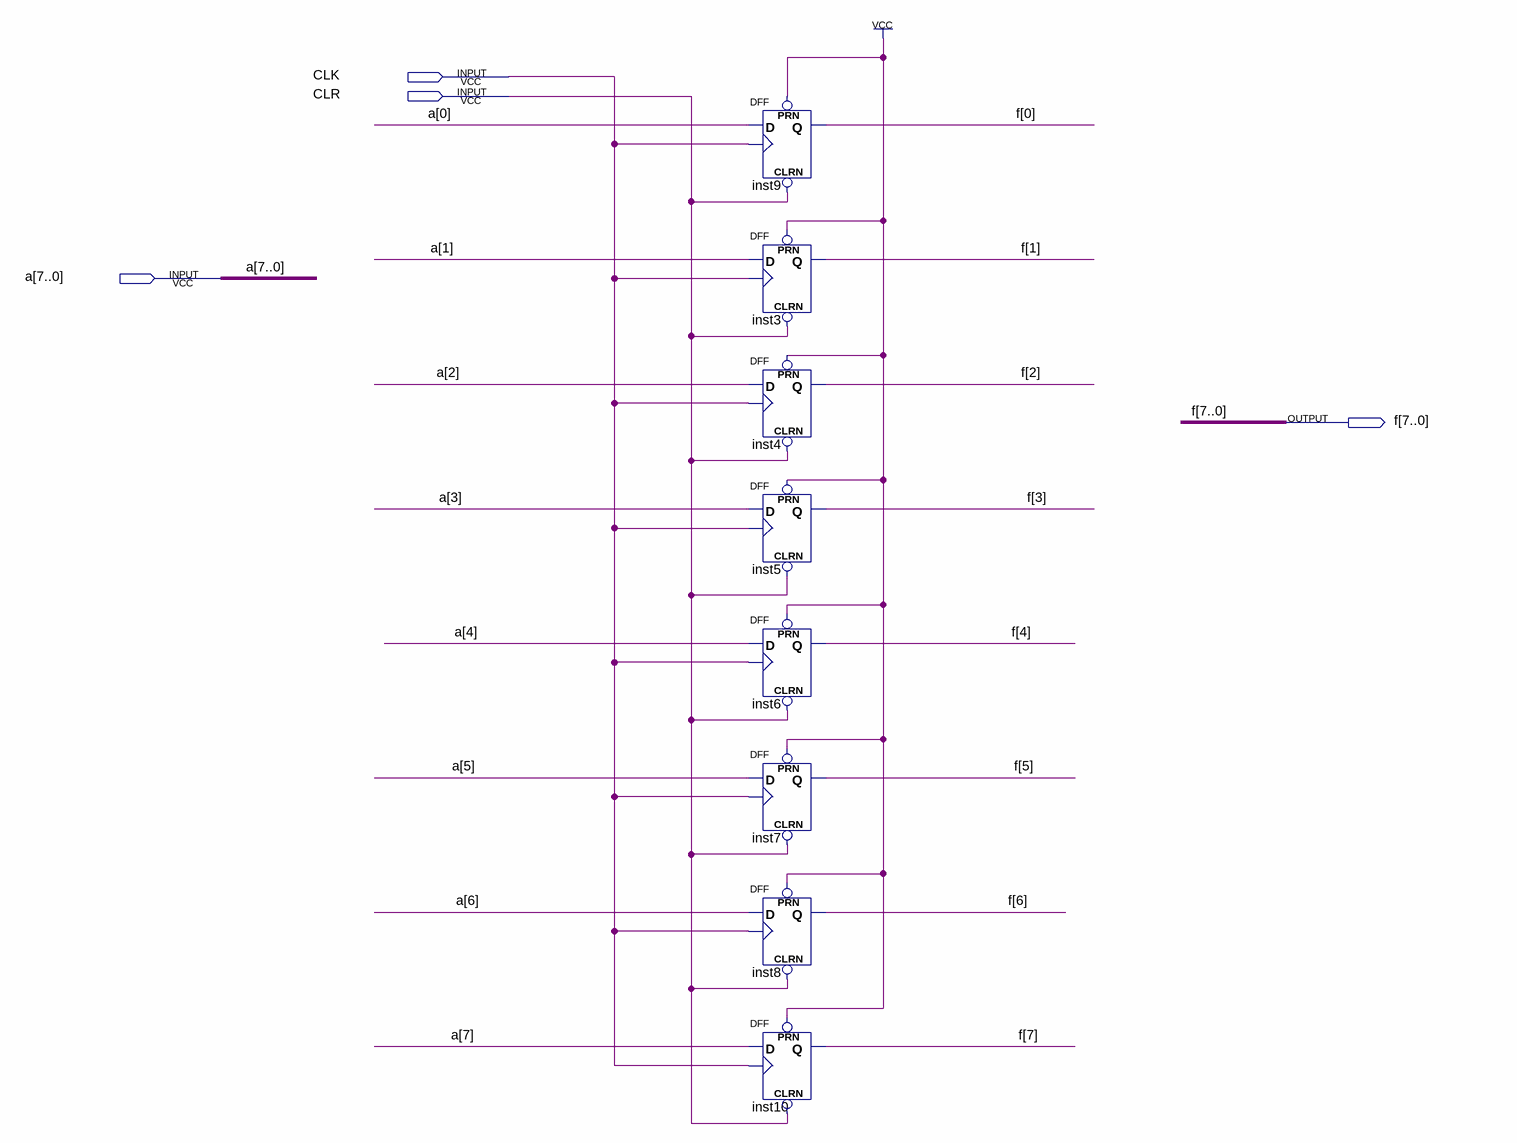
[diagram p0: schematic sheet]
// Quartus schematic register_CLR.bdf as structural Verilog: 8 symbols, 4 pins
module register_CLR (
  input  CLK,
  input  CLR,
  input  [7:0] a,
  output [7:0] f
);

  DFF inst9 (.CLRN(CLR), .CLK(CLK), .D(a[0]), .PRN(1'b1), .Q(f[0]));
  DFF inst3 (.CLRN(CLR), .CLK(CLK), .D(a[1]), .PRN(1'b1), .Q(f[1]));
  DFF inst4 (.CLRN(CLR), .CLK(CLK), .D(a[2]), .PRN(1'b1), .Q(f[2]));
  DFF inst5 (.CLRN(CLR), .CLK(CLK), .D(a[3]), .PRN(1'b1), .Q(f[3]));
  DFF inst6 (.CLRN(CLR), .CLK(CLK), .D(a[4]), .PRN(1'b1), .Q(f[4]));
  DFF inst7 (.CLRN(CLR), .CLK(CLK), .D(a[5]), .PRN(1'b1), .Q(f[5]));
  DFF inst8 (.CLRN(CLR), .CLK(CLK), .D(a[6]), .PRN(1'b1), .Q(f[6]));
  DFF inst10 (.CLRN(CLR), .CLK(CLK), .D(a[7]), .PRN(1'b1), .Q(f[7]));
endmodule
